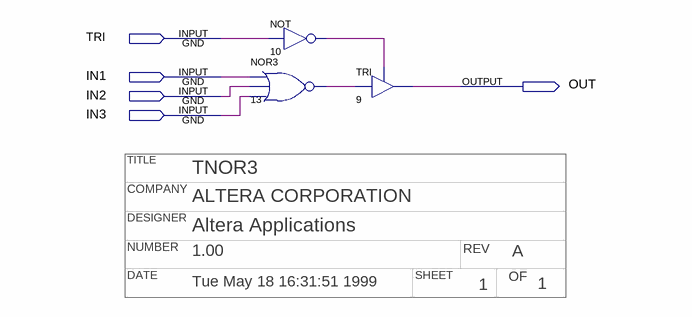
[diagram p0: schematic sheet]
// Quartus schematic tnor3.bdf as structural Verilog: 3 symbols, 5 pins
// Title block: TITLE: TNOR3; COMPANY: ALTERA CORPORATION; DESIGNER: Altera Applications; NUMBER: 1.00; REV: A; DATE: Tue May 18 16:31:51 1999; SHEET: 1; OF: 1
module tnor3 (
  input  TRI,
  input  IN1,
  input  IN2,
  input  IN3,
  output OUT
);

  wire n10_out, n13_out;

  not u_10 (n10_out, TRI);
  nor u_13 (n13_out, IN1, IN2, IN3);
  TRI u_9 (.IN(n13_out), .OE(n10_out), .OUT(OUT));
endmodule
